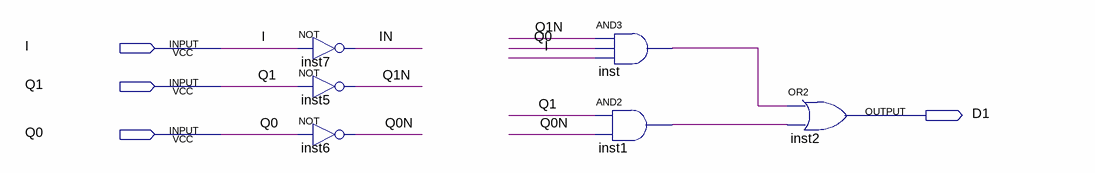
[diagram p0: schematic sheet]
// Quartus schematic D1.bdf as structural Verilog: 6 symbols, 4 pins
module D1 (
  input  I,
  input  Q1,
  input  Q0,
  output D1
);

  wire IN, inst1_out, inst_out, Q0N, Q1N;

  not inst7 (IN, I);
  not inst5 (Q1N, Q1);
  not inst6 (Q0N, Q0);
  and inst (inst_out, Q1N, Q0, I);
  and inst1 (inst1_out, Q1, Q0N);
  or inst2 (D1, inst_out, inst1_out);
endmodule
